# Altium schematic sheet JacdacDevRgbEc30 117.SchDoc: Complete design
size A4; DocumentNumber: 1; SheetNumber: 1; SheetTotal: 1; VersionControl_RevNumber: 1
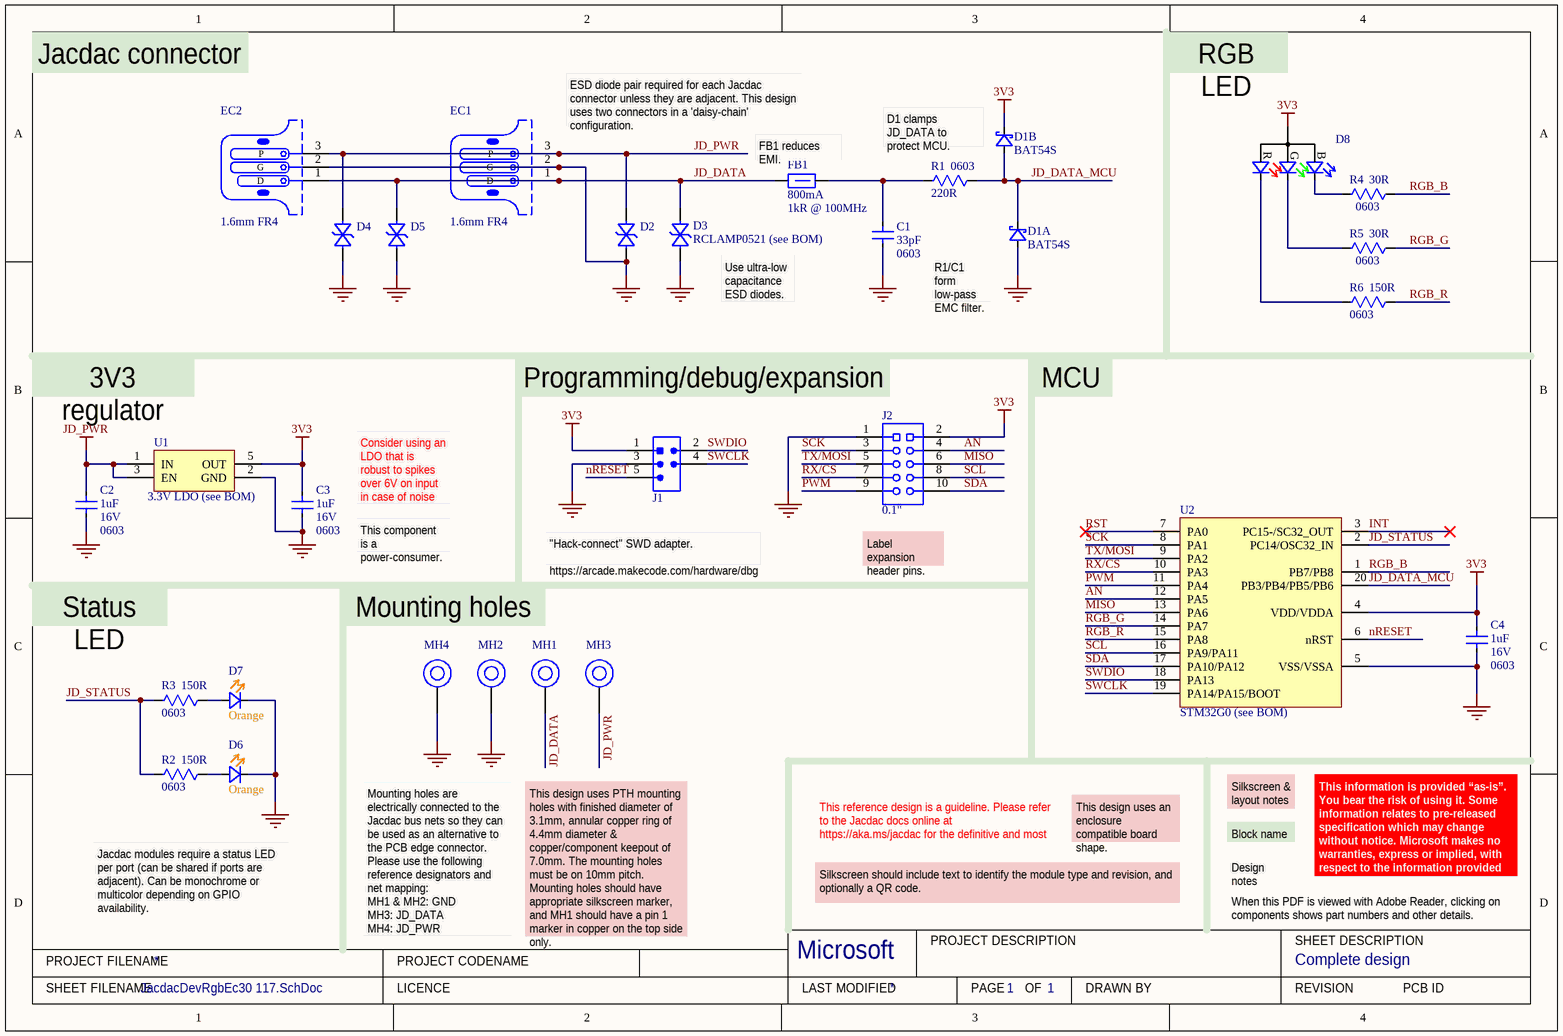
[diagram p0: JacdacDevRgbEc30 117.SchDoc]

## Parts
C1  Case/Package: 0603  [CC0603]  (hidden comment: 33pF)
C2  Voltage: 16V  Case/Package: 0603  Capacitance: 1uF  [C0603 - without outline]  (hidden comment: 1uF 16V)
C3  Voltage: 16V  Case/Package: 0603  Capacitance: 1uF  [C0603 - without outline]  (hidden comment: 1uF 16V)
C4  Voltage: 16V  Case/Package: 0603  Capacitance: 1uF  [C0603 - without outline]  (hidden comment: 1uF 16V)
D1  BAT54S  [NXP-BAT54S-TO-236AB - without outline]  (parts A,B of 2)
D2  RCLAMP0521P-N  [TVS 0402 - XL]  (value not drawn)
D3  Manufacturer Part Number: RCLAMP0521 (see BOM)  [TVS 0402 - XL]  (hidden comment: RCLAMP0521P-N)
D4  RCLAMP0521P-N  [TVS 0402 - XL]  (value not drawn)
D5  RCLAMP0521P-N  [TVS 0402 - XL]  (value not drawn)
D6  Colour: Orange  [0603 Orange]  (hidden comment: 19-217/S2C-AQ1R1B/3T)
D7  Colour: Orange  [0603 Orange]  (hidden comment: 19-217/S2C-AQ1R1B/3T)
D8  TZ-P4-1615RGBTCA1-0.55T  [TZ-P4-1615RGBTCA1-0.55T]  (value not drawn)
EC1  PCB Type: 1.6mm FR4  [JACDAC_EDGE_CONNECTOR_NO_TRACES]  (hidden comment: 3 pin JACDAC edge connector)  (no BOM)
EC2  PCB Type: 1.6mm FR4  [JACDAC_EDGE_CONNECTOR_NO_TRACES]  (hidden comment: 3 pin JACDAC edge connector)  (no BOM)
FB1  Current Rating: 800mA  Impedance: 1kR @ 100MHz  [TDK MPZ1608 0.8mm - without outline]  (hidden comment: TDK MPZ1608S102ATA00)
J1  Hack Connect Mini 1.27 mm pitch 2-row  [HACK_CONNECT_MINI_5_X_1_27]  (value not drawn)  (no BOM)
J2  0.1"  [Generic 2x5 2.54mm header]  (no BOM)
MH1  MH_7.0MMK_4.4MMC_3.1MMD_PTH  [MH_7.0MMK_4.4MMC_3.1MMD_PTH]  (value not drawn)  (no BOM)
MH2  MH_7.0MMK_4.4MMC_3.1MMD_PTH  [MH_7.0MMK_4.4MMC_3.1MMD_PTH]  (value not drawn)  (no BOM)
MH3  MH_7.0MMK_4.4MMC_3.1MMD_PTH  [MH_7.0MMK_4.4MMC_3.1MMD_PTH]  (value not drawn)  (no BOM)
MH4  MH_7.0MMK_4.4MMC_3.1MMD_PTH  [MH_7.0MMK_4.4MMC_3.1MMD_PTH]  (value not drawn)  (no BOM)
R1  Case/Package: 0603  [RC0603]  (hidden comment: 220R)
R2  Case/Package: 0603  [RC0603]  (hidden comment: 150R)
R3  Case/Package: 0603  [RC0603]  (hidden comment: 150R)
R4  Case/Package: 0603  [RC0603]  (hidden comment: 30R)
R5  Case/Package: 0603  [RC0603]  (hidden comment: 30R)
R6  Case/Package: 0603  [RC0603]  (hidden comment: 150R)
U1  3.3V LDO (see BOM)  [MICRONE-SOT23-5]
U2  STM32G0 (see BOM)  [20-TSSOP]

## Nets
3V3: C3.2 C4.2 D1.2(K) D8.1(A) J1.1(VCC) J2.2 U1.5(OUT) U2.4(VDD/VDDA)
GND: C1.1 C2.1 C3.1 C4.1 D1.1(A) D2.2(A) D3.2(A) D4.2(A) D5.2(A) D6.1(K) D7.1(K) EC1.2(G) EC2.2(G) J1.3(GND) J2.1 MH2.1 MH4.1 U1.2(GND) U2.5(VSS/VSSA)
JD_PWR: C2.2 D2.1(K) D4.1(K) EC1.3(P) EC2.3(P) MH3.1 U1.1(IN) U1.3(EN)
AN: J2.4 U2.12(PA5)
INT: U2.3(PC15-/SC32_OUT)
JD_DATA: D3.1(K) D5.1(K) EC1.1(D) EC2.1(D) FB1.1 MH1.1
JD_DATA_MCU: D1.3(K) R1.2 U2.20(PB3/PB4/PB5/PB6)
JD_STATUS: R2.1 R3.1 U2.2(PC14/OSC32_IN)
MISO: J2.6 U2.13(PA6)
nRESET: J1.5(RESET) U2.6(nRST)
PWM: J2.9 U2.11(PA4)
RGB_B: R4.2 U2.1(PB7/PB8)
RGB_G: R5.2 U2.14(PA7)
RGB_R: R6.2 U2.15(PA8)
RST: U2.7(PA0)
RX/CS: J2.7 U2.10(PA3)
SCK: J2.3 U2.8(PA1)
SCL: J2.8 U2.16(PA9/PA11)
SDA: J2.10 U2.17(PA10/PA12)
SWCLK: J1.4(SWCLK) U2.19(PA14/PA15/BOOT)
SWDIO: J1.2(SWDIO) U2.18(PA13)
TX/MOSI: J2.5 U2.9(PA2)
NetC1_2: C1.2 FB1.2 R1.1
NetD6_2: D6.2(A) R2.2
NetD7_2: D7.2(A) R3.2
NetD8_2: D8.2(R) R6.1
NetD8_3: D8.3(G) R5.1
NetD8_4: D8.4(B) R4.1

## Notes on the sheet
- Jacdac connector
- RGB LED
- ESD diode pair required for each Jacdac connector unless they are adjacent. This design uses two connectors in a 'daisy-chain' configuration.
- (near FB1) FB1 reduces EMI.
- D1 clamps JD_DATA to protect MCU.
- (near D3) Use ultra-low capacitance ESD diodes.
- R1/C1 form low-pass EMC filter.
- 3V3 regulator
- Programming/debug/expansion
- MCU
- Consider using an LDO that is robust to spikes over 6V on input in case of noise on JD_PWR.
- This component is a power-consumer.
- "Hack-connect" SWD adapter.
  https://arcade.makecode.com/hardware/dbg
- (near J2) Label expansion header pins.
- Status LED
- Mounting holes
- This reference design is a guideline. Please refer to the Jacdac docs online at https://aka.ms/jacdac for the definitive and most up-to-date information.
- This design uses an enclosure compatible board shape.
- Block name
- Silkscreen & layout notes
- Jacdac modules require a status LED per port (can be shared if ports are adjacent). Can be monochrome or multicolor depending on GPIO availability.
- Mounting holes are electrically connected to the Jacdac bus nets so they can be used as an alternative to the PCB edge connector. Please use the following reference designators and net mapping:
- Silkscreen should include text to identify the module type and revision, and optionally a QR code.
- Design notes
- When this PDF is viewed with Adobe Reader, clicking on components shows part numbers and other details.
- This information is provided “as-is”. You bear the risk of using it. Some information relates to pre-released specification which may change without notice. Microsoft makes no warranties, express or implied, with respect to the information provided here.
- MH1 & MH2: GND
  MH3: JD_DATA
  MH4: JD_PWR
- This design uses PTH mounting holes with finished diameter of 3.1mm, annular copper ring of 4.4mm diameter & copper/component keepout of 7.0mm. The mounting holes must be on 10mm pitch.
  Mounting holes should have appropriate silkscreen marker, and MH1 should have a pin 1 marker in copper on the top side only.
- PROJECT FILENAME
- PROJECT CODENAME
- Microsoft
- PROJECT DESCRIPTION
- SHEET DESCRIPTION
- SHEET FILENAME
- LICENCE
- LAST MODIFIED
- PAGE
- OF
- DRAWN BY
- REVISION
- PCB ID

## Library data of the parts
C1 = CC0603JRNPO9BN330: Cap 33PF 50V 0603 SMD 5% NP0; Manufacturer: Yageo; Dielectric Material: Ceramic; Dielectric: C0G; Temperature Coefficient: 30ppm/°C; Insulation Resistance: 100GR; ComponentLink2URL: https://datasheet.ciiva.com/144/mlccorderingcode-144075.pdf?src-supplier=Digi-Key; ComponentLink2Description: Online part number coding; ComponentLink3URL: https://datasheet.ciiva.com/17434/upy-gphc-x7r-6-3v-to-50v-8-17434263.pdf; ComponentLink3Description: Online datasheet; ComponentLink4URL: https://datasheet.ciiva.com/26829/getdatasheetpartid-403577-26829431.pdf; ComponentLink4Description: Online datasheet; Supplier 1: Digi-Key; Manufacturer Part Number: CC0603JRNPO9BN330; RoHS: Yes; Category: Ceramic Capacitors; Stock 1: 422723; Pricing 1: 4000=0.00888, 8000=0.00811 (USD); Mount: Surface Mount; Number of Pins: 2; Case Code (Metric): 1608; Case Code (Imperial): 0603; Min Operating Temperature: -55°C; Max Operating Temperature: 125°C; Packaging: Tape and Reel; Voltage Rating: 50V; Package Quantity: 1; Voltage Rating (DC): 50V; Termination: SMD/SMT; Resistor Type: Ceramic; Voltage: 50V; Series: CC; Length: 1.6mm; Width: 0.031inch; Height: 0.8mm; Thickness: 0.035inch; Depth: 0.8mm; Radiation Hardening: No; REACH SVHC: No SVHC; Lead Free: Lead Free; RoHS Compliant: Yes; ComponentLink1URL: https://datasheet.ciiva.com/11786/0900766b8079c870-11786082.pdf?src-supplier=RSComponents; ComponentLink1Description: https://datasheet.ciiva.com/11786/0900766b8079c870-11786082.pdf?src-supplier=RSComponents; ComponentLink5URL: https://datasheet.ciiva.com/26862/getdatasheetpartid-403532-26862767.pdf?src-supplier=Verical; ComponentLink5Description: https://datasheet.ciiva.com/26862/getdatasheetpartid-403532-26862767.pdf?src-supplier=Verical; ComponentLink6URL: https://datasheet.ciiva.com/8033/1443161-8033735.pdf?src-supplier=Element14; ComponentLink6Description: https://datasheet.ciiva.com/8033/1443161-8033735.pdf?src-supplier=Element14; ComponentLink7URL: https://datasheet.ciiva.com/7978/1443161-7978142.pdf?src-supplier=Element14; ComponentLink7Description: https://datasheet.ciiva.com/7978/1443161-7978142.pdf?src-supplier=Element14; ComponentLink8URL: https://datasheet.ciiva.com/46430/1835847-46430155.pdf?src-supplier=Element14; ComponentLink8Description: https://datasheet.ciiva.com/46430/1835847-46430155.pdf?src-supplier=Element14; ComponentLink9URL: https://datasheet.ciiva.com/144/mlccorderingcode-144644.pdf?src-supplier=Digi-Key; ComponentLink9Description: https://datasheet.ciiva.com/144/mlccorderingcode-144644.pdf?src-supplier=Digi-Key; ComponentLink10URL: https://datasheet.ciiva.com/144/mlccorderingcode-144643.pdf?src-supplier=Digi-Key; ComponentLink10Description: https://datasheet.ciiva.com/144/mlccorderingcode-144643.pdf?src-supplier=Digi-Key; ComponentLink11URL: https://datasheet.ciiva.com/144/mlccorderingcode-144645.pdf?src-supplier=Digi-Key; ComponentLink11Description: https://datasheet.ciiva.com/144/mlccorderingcode-144645.pdf?src-supplier=Digi-Key; ComponentLink12URL: https://datasheet.ciiva.com/5426/upy-gp-np0-16v-to-50v-8-5426614.pdf?src-supplier=Mouser; ComponentLink12Description: https://datasheet.ciiva.com/5426/upy-gp-np0-16v-to-50v-8-5426614.pdf?src-supplier=Mouser; ComponentLink13URL: https://datasheet.ciiva.com/8033/1372269-8033734.pdf?src-supplier=Element14; ComponentLink13Description: https://datasheet.ciiva.com/8033/1372269-8033734.pdf?src-supplier=Element14; ComponentLink14URL: https://datasheet.ciiva.com/11464/upy-gp-np0-16v-to-50v-8-11464730.pdf?src-supplier=Avnet; ComponentLink14Description: https://datasheet.ciiva.com/11464/upy-gp-np0-16v-to-50v-8-11464730.pdf?src-supplier=Avnet; Supplier 2: Farnell; Supplier 3: RSComponents; Supplier 4: Mouser; Supplier 5: LCSC; Supplier Part Number 5: C107047; Supplier Part Number 4: 603-C0603JRNPO9BN330; Supplier Part Number 3: 2006492; Supplier Part Number 2: 2408499; Supplier Part Number 1: 311-1064-2-ND; Capacitance: 33pF; Tolerance: 5%; Manufacturer Part Number 1: CC0603JRNPO9BN330; Manufacturer 1: Yageo
C2-C4 = CL10A105KO8NNNC: SMD Multilayer Ceramic Capacitor, 1 µF, 16 V, 0603 [1608 Metric], ± 10%, X5R, CL Series; Manufacturer: Samsung; ComponentLink1URL: https://datasheet.lcsc.com/lcsc/1811021622_Samsung-Electro-Mechanics-CL10A105KO8NNNC_C1592.pdfq; ComponentLink1Description: Online datasheet; Supplier 1: Digi-Key; Manufacturer Part Number: CL10A105KO8NNNC; RoHS: Yes; Category: Ceramic Capacitors; Stock 1: 3575337; Pricing 1: 1=0.10000, 10=0.03600, 50=0.01960, 100=0.01600, 500=0.01144, 1000=0.00898 (USD); Mount: Surface Mount; Case Code (Metric): 1608; Case Code (Imperial): 0603; Material: Ceramic; Contact Plating: Tin; Min Operating Temperature: -55°C; Max Operating Temperature: 85°C; Tolerance: 10%; Package Quantity: 1; Packaging: Tape and Reel; Voltage Rating: 16V; Dielectric: X5R; Voltage Rating (DC): 16V; Series: CL; Construction: Flat; Length: 1.6mm; Width: 0.031inch; Height: 0.8mm; Thickness: 0.035inch; Depth: 0.8mm; Radiation Hardening: No; Lead Free: Lead Free; RoHS Compliant: Yes; Supplier 2: Farnell; Supplier 3: RSComponents; Supplier 4: Mouser; Supplier Part Number 1: 1276-1034-1-ND; Supplier Part Number 2: 3013384; Supplier Part Number 3: 7664780; Supplier Part Number 4: 187-CL10A105KO8NNNC; Supplier 5: LCSC; Supplier Part Number 5: C1592; Manufacturer Part Number 1: CL10A105KO8NNNC; Manufacturer 1: Samsung
D1 = BAT54S: DIODE ARRAY SCHOTTKY 30V SOT23; Manufacturer: Nexperia; Supplier 1: Digi-Key; RoHS: No; Category: Rectifier Diodes; Stock 1: 14011; Pricing 1: 1=0.13000, 10=0.11900, 100=0.05610, 500=0.03326, 1000=0.02185, 5000=0.02138 (USD); ComponentLink1URL: https://assets.nexperia.com/documents/data-sheet/BAT54_SER.pdf; ComponentLink1Description: NXP datasheet online; Supplier 2: Mouser; Supplier 3: RSComponents; Supplier Part Number 2: 771-BAT54S235; Supplier Part Number 3: 1707990; Supplier Part Number 1: 1727-1868-1-ND; Manufacturer Part Number: BAT54S; Manufacturer Part Number 1: BAT54S; Manufacturer 1: Nexperia
D2-D5 = RCLAMP0521P-N: Bidirectional 5V (Max) 6V 16V 3.5A (8/20us) 0402 TVS RoHS; Manufacturer: Born Semiconductor; Package: 0402; Created By: D Gakure; Checked By: ?; Supplier 1: LCSC; Supplier Part Number 1: C316043; ComponentLink1Description: Online datasheet; ComponentLink1URL: https://datasheet.lcsc.com/szlcsc/Bourne-Semicon-Shenzhen-RCLAMP0521P-N_C316043.pdf; Manufacturer 1: Born Semiconductor
  D2 D4 D5: Manufacturer Part Number: RCLAMP0521P-N; Manufacturer Part Number 1: RCLAMP0521P-N
  D3: Manufacturer Part Number 1: RCLAMP0521 (see BOM)
D6 D7 = 19-217/S2C-AQ1R1B/3T: LED ORANGE DIFFUSED 0603 SMD; Manufacturer: Everlight Elec; Manufacturer Part Number: 19-217/S2C-AQ1R1B/3T; Mount: Surface Mount; Case/Package: 0603; Color: Orange; Case Code (Imperial): 0603; ComponentLink1URL: https://datasheet.lcsc.com/lcsc/1912171731_Everlight-Elec-19-217-S2C-AQ1R1B-3T_C146215.pdf; ComponentLink1Description: Online datasheet; Supplier 1: LCSC; Supplier Part Number 1: C146215; Manufacturer Part Number 1: 19-217/S2C-AQ1R1B/3T; Manufacturer 1: Everlight Elec
D8 = TZ-P4-1615RGBTCA1-0.55T: 1615 Light Emitting Diodes (LED) RoHS; Manufacturer: TUOZHAN; Manufacturer Part Number: TZ-P4-1615RGBTCA1-0.55T; Category: Optoelectronics; Package: 1615; ComponentLink1Description: Online datasheet; ComponentLink1URL: https://datasheet.lcsc.com/szlcsc/2009041238_TUOZHAN-TZ-P4-1615RGBTCA1-0-55T_C779813.pdf; RoHS: RoHS Compliant; Supplier 1: LCSC; Size / Dimension: 1.6x1.5mm; Supplier Part Number 1: C779813; Packaging: Tape & Reel (TR); Created By: D. Gakure; Checked By: ?; Manufacturer Part Number 1: TZ-P4-1615RGBTCA1-0.55T; Manufacturer 1: TUOZHAN
EC1 EC2 = Jacdac edge connector: 3 pin Jacdac edge connector 1.27mm pitch; Manufacturer Part Number: JACDAC_EDGE_CONNECTOR; Checked By: ?; Created By: D. Gakure; ComponentLink1Description: Yuliang JACDAC cable connector drawing online; ComponentLink1URL: https://github.com/microsoft/jacdac-mdk/blob/main/connector/JACDAC-Connector-by-Yuliang-2020-11-28.pdf; ComponentLink2Description: JACDAC PCB edge connector spec onlin; ComponentLink2URL: https://github.com/microsoft/jacdac-mdk/blob/main/connector/JACDAC_PCB_Edge_Connector_Drawing_JD-PEC-01_rev_01.pdf; Manufacturer Part Number 1: JACDAC_EDGE_CONNECTOR
FB1 = TDK MPZ1608S102ATA00: 0603 1k@100MHz 0.8A chip; Core Material: Ferrite; Tolerance: 25%; DC Resistance (DCR): 300mR; Supplier 1: Digi-Key; Stock 1: 113542; Pricing 1: 1=0.1, 10=0.079, 25=0.0716, 50=0.0644, 100=0.0472, 250=0.03432, 500=0.03146, 1000=0.02717 (USD); Mount: Surface Mount; Case/Package: 0603; Case Code (Metric): 1608; Case Code (Imperial): 0603; Package Quantity: 4000; Packaging: Tape and Reel; Max DC Current: 800mA; Length: 0.063inch; Height: 0.037inch; Width: 0.031inch; ComponentLink2URL: https://www.mouser.co.uk/datasheet/2/400/eads_commercial_power_mpz1608_en-923650.pdf; ComponentLink2Description: datasheet online; Supplier 2: Mouser; ComponentLink3Description: datasheet; ComponentLink3URL: Y:\System\Altium\Libraries 2014\TDK\Datasheets\eads_commercial_power_mpz1608_en-923650.pdf; Supplier Part Number 1: 445-8694-1-ND; Supplier Part Number 2: 810-MPZ1608S102ATA00; Manufacturer: TDK; Manufacturer Part Number: MPZ1608S102ATA00; Manufacturer Part Number 1: MPZ1608S102ATA00; Manufacturer 1: TDK
J1 = HACK_CONNECT_MINI
J2 = Header Multicomp 2213S-10G-whitesch: 2.54mm, 5x2 way, vertical, square pin, gold plate; Insulation Resistance: 1GR; Gender: Male; Number of Contacts: 10; ComponentLink1URL: http://www.farnell.com/datasheets/1697530.pdf; ComponentLink1Description: mulitcomp datasheet; Supplier 1: Farnell; Manufacturer: Multicomp; Manufacturer Part Number: 2213S-10G; Stock 1: 90304; Pricing 1: 50=0.05290, 500=0.03900, 1500=0.03370, 2500=0.02750, 5000=0.02660, 10000=0.02550, 30000=0.02460, 50000=0.02360 (GBP); RoHS: Yes; Mount: Through Hole; Weight: 0.11lb; Contact Material: Copper Alloy; Contact Plating: Gold; Termination: Through Hole; Number of Rows: 2; Length: 0.51inch; Height: 0.47inch; Width: 0.2inch; REACH SVHC: No SVHC; Flammability Rating: UL94 V-0; Supplier Part Number 1: 1593442
MH1-MH4 = MH_7.0MMK_4.4MMC_3.1MMD_PTH: Mounting Hole 7.0mm keepout, 4.4mm annualar ring and 3.1mm Drill PTH; Hole Size: M3; Hole Diameter: 3.1mm; Hole Type: PTH; Annular Ring: 4.4mm; Hole Clearance: 7.0mm
R1 = RC0603FR-07220RL: Res Thick Film 0603 220 Ohm 1% 0.1W(1/10W) ±100ppm/°C Pad SMD T/R; Manufacturer: Yageo; Max Power Dissipation: 100mW; Voltage Rating: 50V; ComponentLink1URL: https://datasheet.ciiva.com/11819/0900766b80f96399-11819290.pdf; ComponentLink1Description: Online datasheet; Supplier 1: Digi-Key; Manufacturer Part Number: RC0603FR-07220RL; RoHS: Yes; Category: Chip SMD Resistors; Stock 1: 242327; Pricing 1: 1=0.10000, 10=0.02400, 100=0.00970, 1000=0.00436, 2500=0.00378 (USD); Number of Pins: 2; Case Code (Imperial): 0603; Case Code (Metric): 1608; Size Code: 0603; Min Operating Temperature: -55°C; Max Operating Temperature: 155°C; Packaging: Tape and Reel; Tolerance: 1%; Resistor Type: Thick Film; Number of Terminations: 2; Temperature Coefficient: 100ppm/°C; Series: RC; Power Rating: 100mW; Package Quantity: 1; Features: Moisture Resistant; Voltage Rating (DC): 50V; Termination: SMD/SMT; Construction: Rectangular; Length: 1.6mm; Width: 0.031inch; Height: 0.022inch; Depth: 0.8mm; RoHS Compliant: Yes; REACH SVHC: No SVHC; Military Standard: Not; Lead Free: Lead Free; Supplier 2: Farnell; Supplier 3: RSComponents; Supplier 4: Mouser; Supplier Part Number 1: 311-220HRCT-ND; Supplier Part Number 3: 1995497; Supplier Part Number 2: 9238409; Supplier Part Number 4: 603-RC0603FR-07220RL; Supplier 5: LCSC; Supplier Part Number 5: C107696; Resistance Tolerance: 1%; Resistance: 220R; Manufacturer Part Number 1: RC0603FR-07220RL; Manufacturer 1: Yageo
R2 R3 R6 = RC0603FR-07150RL: Res General Purpose Thick Film 0603 150 Ohm 1% 1/10W ±100ppm/°C Molded SMD Paper T/R; Manufacturer: Yageo; Power Rating: 100mW; Voltage Rating (DC): 50V; ComponentLink1URL: https://datasheet.ciiva.com/11819/0900766b80f96399-11819290.pdf; ComponentLink1Description: Online datasheet; Supplier 1: Digi-Key; Manufacturer Part Number: RC0603FR-07150RL; RoHS: Yes; Category: Chip SMD Resistors; Stock 1: 2262542; Pricing 1: 1=0.10000, 10=0.02400, 100=0.00970, 1000=0.00436, 2500=0.00378 (USD); Number of Pins: 2; Case Code (Imperial): 0603; Case Code (Metric): 1608; Size Code: 0603; Min Operating Temperature: -55°C; Max Operating Temperature: 155°C; Tolerance: 1%; Packaging: Tape and Reel; Temperature Coefficient: 100ppm/°C; Voltage Rating: 50V; Package Quantity: 5000; Termination: SMD/SMT; Resistor Type: Thick Film; Features: Moisture Resistant; Series: RC; Max Power Dissipation: 100mW; Number of Terminations: 2; Construction: Rectangular; Length: 1.6mm; Width: 0.8mm; Height: 0.45mm; Depth: 0.8mm; REACH SVHC: No SVHC; Lead Free: Lead Free; Military Standard: Not; RoHS Compliant: Yes; Supplier 2: Farnell; Supplier 3: RSComponents; Supplier 4: Mouser; Supplier Part Number 1: 311-150HRCT-ND; Supplier Part Number 2: 9238387; Supplier Part Number 3: 1995464; Supplier Part Number 4: 603-RC0603FR-07150RL; Supplier 5: LCSC; Supplier Part Number 5: C114608; Resistance Tolerance: 1%; Resistance: 150R; Manufacturer Part Number 1: RC0603FR-07150RL; Manufacturer 1: Yageo
R4 R5 = RC0603FR-0730RL: Res Thick Film 0603 30 Ohm 1% 0.1W(1/10W) ±100ppm/C Pad SMD T/R; Manufacturer: Yageo; Temperature Coefficient: 100ppm/°C; Voltage Rating (DC): 50V; Power Rating: 100mW; ComponentLink1URL: https://datasheet.ciiva.com/11819/0900766b80f96399-11819290.pdf; ComponentLink1Description: Online datasheet; Supplier 1: Digi-Key; Manufacturer Part Number: RC0603FR-0730RL; RoHS: Yes; Category: Chip SMD Resistors; Stock 1: 181493; Pricing 1: 1=0.10000, 10=0.02400, 100=0.00970, 1000=0.00436, 2500=0.00378 (USD); Mount: Surface Mount; Case Code (Imperial): 0603; Size Code: 0603; Min Operating Temperature: -55°C; Max Operating Temperature: 155°C; Resistor Type: Thick Film; Packaging: Tape and Reel; Package Quantity: 1; Voltage Rating: 50V; Number of Terminations: 2; Termination: SMD/SMT; Max Power Dissipation: 100mW; Features: Moisture Resistant; Series: RC; Construction: Rectangular; Technology: THICK FILM; Length: 0.063inch; Width: 0.031inch; Height: 0.022inch; Depth: 0.8mm; Lead Free: Lead Free; Military Standard: Not; RoHS Compliant: Yes; ComponentLink2URL: https://datasheet.ciiva.com/11819/0900766b80c66297-11819676.pdf?src-supplier=RSComponents; ComponentLink2Description: https://datasheet.ciiva.com/11819/0900766b80c66297-11819676.pdf?src-supplier=RSComponents; ComponentLink3URL: https://datasheet.ciiva.com/2455/pyu-r-int-thick-7-2455119.pdf?src-supplier=Digi-Key; ComponentLink3Description: https://datasheet.ciiva.com/2455/pyu-r-int-thick-7-2455119.pdf?src-supplier=Digi-Key; ComponentLink4URL: https://datasheet.ciiva.com/2455/pyu-r-int-thick-7-2455120.pdf?src-supplier=Digi-Key; ComponentLink4Description: https://datasheet.ciiva.com/2455/pyu-r-int-thick-7-2455120.pdf?src-supplier=Digi-Key; ComponentLink5URL: https://datasheet.ciiva.com/2455/pyu-r-int-thick-7-2455121.pdf?src-supplier=Digi-Key; ComponentLink5Description: https://datasheet.ciiva.com/2455/pyu-r-int-thick-7-2455121.pdf?src-supplier=Digi-Key; Supplier 2: Farnell; Supplier 3: Mouser; Case Code (Metric): 1608; Supplier Part Number 1: 311-30.0HRCT-ND; Supplier Part Number 2: 3495813; Supplier Part Number 3: 603-RC0603FR-0730RL; Supplier 5: LCSC; Supplier Part Number 5: C128060; Tolerance: 1%; Resistance: 30R; Manufacturer Part Number 1: RC0603FR-0730RL; Manufacturer 1: Yageo
U1 = ME6211C33M5G-N: 6V 260mV @ 200mA(typ) - - Fixed 3.3V SOT-23-5 Linear Voltage Regulators (LDO) ROHS; Manufacturer: MICRONE(Nanjing Micro One Elec); Output Current: 500mA; Output Configuration: Positive; Number of Regulators: 1; Max Input Voltage: 6; Dropout Voltage: 200mV; Supplier Part Number 1: C82942; Category: Voltage Regulators - Linear; Stock 1: 32529; Pricing 1: 1=0.33000, 10=0.24900, 25=0.21760, 100=0.12440, 250=0.11664, 500=0.09330, 1000=0.07153 (USD); Mount: Surface Mount; Case/Package: SOT-23-5; Supplier 1: LCSC; Output Type: Fixed; Min Output Voltage: 3.3V; ComponentLink3URL: https://datasheet.lcsc.com/lcsc/1811131510_MICRONE-Nanjing-Micro-One-Elec-ME6211C33M5G-N_C82942.pdf; ComponentLink3Description: On Semi datasheet online; Created: DG; Checked: ?; Manufacturer Part Number: ME6211C33M5G-N; Manufacturer Part Number 1: ME6211C33M5G-N; Manufacturer 1: MICRONE(Nanjing Micro One Elec)
U2 = STM32G031F6P6: MCU 32-Bit STM32G031 ARM Cortex-M0+ RISC 32KB Flash 1.7V to 3.6V 20-Pin TSSOP Tube; Manufacturer: STMicroelectronics; Supplier 1: Digi-Key; RoHS: Yes; Category: Microcontrollers; Stock 1: 166; Pricing 1: 1=2.39000, 10=2.14400, 25=2.02240, 100=1.72330, 250=1.61808, 500=1.41582, 1000=1.17985 (USD); Supplier 2: Farnell; Pricing 2: 1480=0.78200 (GBP); Supplier 3: RSComponents; Created by: D. Gakure; Checked by: ?; Supplier Part Number 2: 3246918; Supplier Part Number 1: 497-19774-ND; Supplier Part Number 3: 1939834; ComponentLink1Description: Online datasheet; ComponentLink1URL: https://www.st.com/resource/en/datasheet/stm32g031c6.pdf; Manufacturer Part Number: STM32G031F6P6; Supplier 4: LCSC; Supplier Part Number 4: C529333; Manufacturer Part Number 1: STM32G031F6P6; Manufacturer 1: STMicroelectronics